# EAGLE design led_12led (EAGLE 7.7.0)
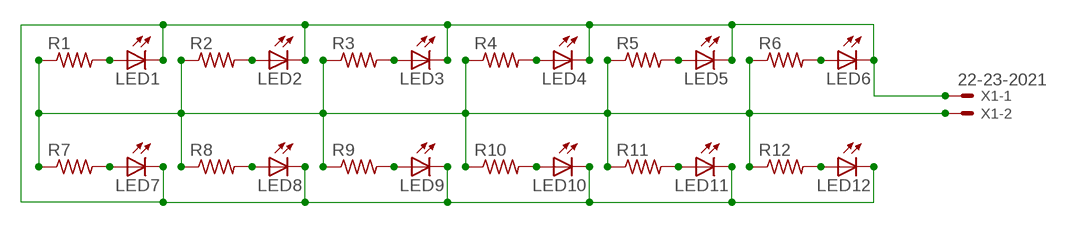
[diagram p0: schematic, sheet 1]

## Parts
LED1  LED3MM  [LED3MM]
LED2  LED3MM  [LED3MM]
LED3  LED3MM  [LED3MM]
LED4  LED3MM  [LED3MM]
LED5  LED3MM  [LED3MM]
LED6  LED3MM  [LED3MM]
LED7  LED3MM  [LED3MM]
LED8  LED3MM  [LED3MM]
LED9  LED3MM  [LED3MM]
LED10  LED3MM  [LED3MM]
LED11  LED3MM  [LED3MM]
LED12  LED3MM  [LED3MM]
R1  R-US_0309/12  [0309/12]
R2  R-US_0309/12  [0309/12]
R3  R-US_0309/12  [0309/12]
R4  R-US_0309/12  [0309/12]
R5  R-US_0309/12  [0309/12]
R6  R-US_0309/12  [0309/12]
R7  R-US_0309/12  [0309/12]
R8  R-US_0309/12  [0309/12]
R9  R-US_0309/12  [0309/12]
R10  R-US_0309/12  [0309/12]
R11  R-US_0309/12  [0309/12]
R12  R-US_0309/12  [0309/12]
X1  22-23-2021  [22-23-2021]

## Nets
N$1: R1.1 R2.1 R3.1 R4.1 R5.1 R6.1 R7.1 R8.1 R9.1 R10.1 R11.1 R12.1 X1.2
N$2: LED1.A R1.2
N$3: LED2.A R2.2
N$4: LED3.A R3.2
N$5: LED4.A R4.2
N$6: LED5.A R5.2
N$7: LED6.A R6.2
N$8: LED7.A R7.2
N$9: LED8.A R8.2
N$10: LED9.A R9.2
N$11: LED10.A R10.2
N$12: LED11.A R11.2
N$13: LED12.A R12.2
N$16: LED1.K(C) LED2.K(C) LED3.K(C) LED4.K(C) LED5.K(C) LED6.K(C) LED7.K(C) LED8.K(C) LED9.K(C) LED10.K(C) LED11.K(C) LED12.K(C) X1.1

## Library data of the parts
LED1-LED12 = led:LED: LED OSRAM: - CHIPLED LG R971, LG N971, LY N971, LG Q971, LY Q971, LO R971, LY R971 LH N974, LH R974 LS Q976, LO Q976, LY Q976 LO Q996 - Hyper CHIPLED LW Q18S LB Q993, LB Q99A, LB R99A - SideLED LS A670, LO A670, LY A670, LG A670, LP A670 LB A673, LV A673, LT A673, LW A673 LH A674 LY A675 LS A676, LA A676, LO A676, LY A676, LW A676 LS A679, LY A679, LG A679 - Hyper Micro SIDELED® LS Y876, LA Y876, LO Y876, LY Y876 LT Y87S - SmartLED LW L88C, LW L88S LB L89C, LB L89S, LG L890 LS L89K, LO L89K, LY L89K LS L896, LA L896, LO L896, LY L896 - TOPLED LS T670, LO T670, LY T670, LG T670, LP T670 LSG T670, LSP T670, LSY T670, LOP T670, LYG T670 LG T671, LOG T671, LSG T671 LB T673, LV T673, LT T673, LW T673 LH T674 LS T676, LA T676, LO T676, LY T676, LB T676, LH T676, LSB T676, LW T676 LB T67C, LV T67C, LT T67C, LS T67K, LO T67K, LY T67K, LW E67C LS E67B, LA E67B, LO E67B, LY E67B, LB E67C, LV E67C, LT E67C LW T67C LS T679, LY T679, LG T679 LS T770, LO T770, LY T770, LG T770, LP T770 LB T773, LV T773, LT T773, LW T773 LH T774 LS E675, LA E675, LY E675, LS T675 LS T776, LA T776, LO T776, LY T776, LB T776 LHGB T686 LT T68C, LB T68C - Hyper Mini TOPLED® LB M676 - Mini TOPLED Santana® LG M470 LS M47K, LO M47K, LY M47K Source: http://www.osram.convergy.de LUXEON: - LUMILED® LXK2-PW12-R00, LXK2-PW12-S00, LXK2-PW14-U00, LXK2-PW14-V00 LXK2-PM12-R00, LXK2-PM12-S00, LXK2-PM14-U00 LXK2-PE12-Q00, LXK2-PE12-R00, LXK2-PE12-S00, LXK2-PE14-T00, LXK2-PE14-U00 LXK2-PB12-K00, LXK2-PB12-L00, LXK2-PB12-M00, LXK2-PB14-N00, LXK2-PB14-P00, LXK2-PB14-Q00 LXK2-PR12-L00, LXK2-PR12-M00, LXK2-PR14-Q00, LXK2-PR14-R00 LXK2-PD12-Q00, LXK2-PD12-R00, LXK2-PD12-S00 LXK2-PH12-R00, LXK2-PH12-S00 LXK2-PL12-P00, LXK2-PL12-Q00, LXK2-PL12-R00 Source: www.luxeon.com KINGBRIGHT: KA-3528ASYC Source: www.kingbright.com
R1-R12 = resistor:R-US_: RESISTOR, American symbol
X1 = con-molex:22-23-2021: .100" (2.54mm) Center Header - 2 Pin; MF: MOLEX; MPN: 22-23-2021; OC_FARNELL: 1462926; OC_NEWARK: 25C3832

## Board
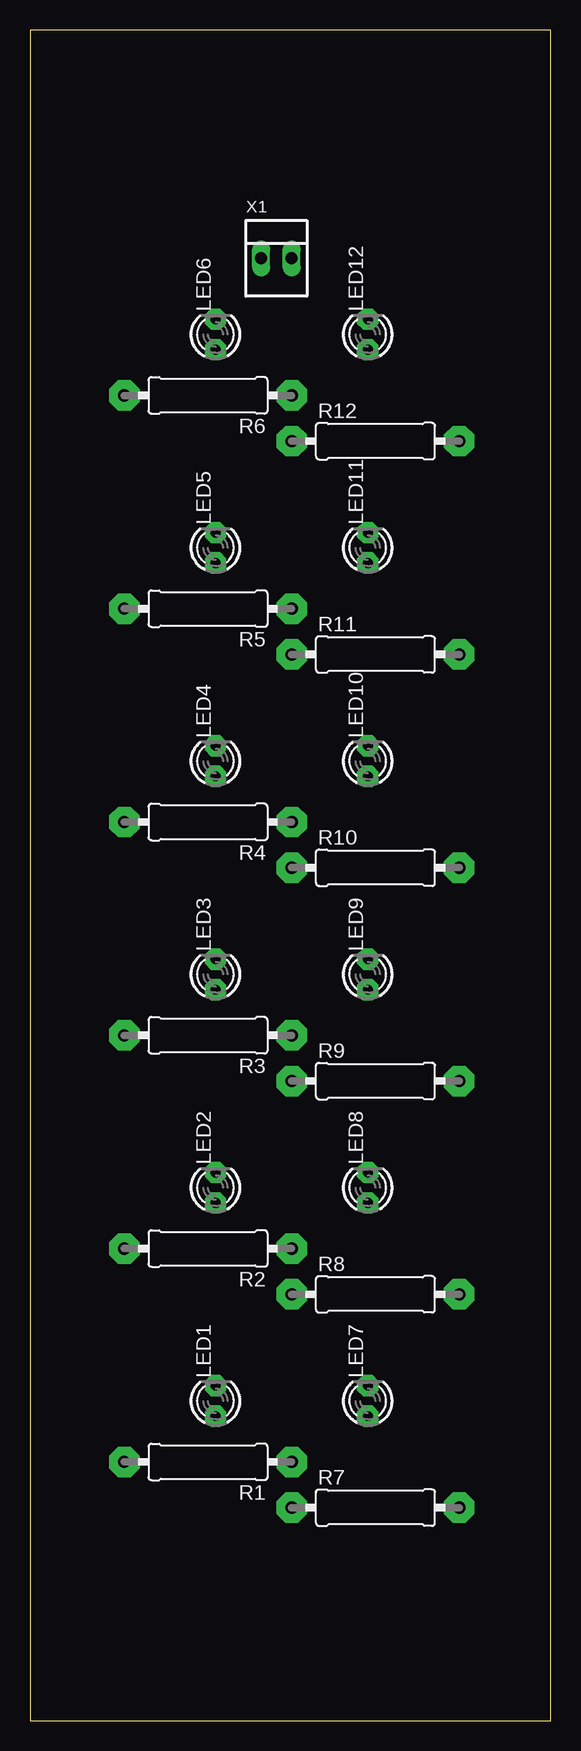
[diagram p1: board, top side]
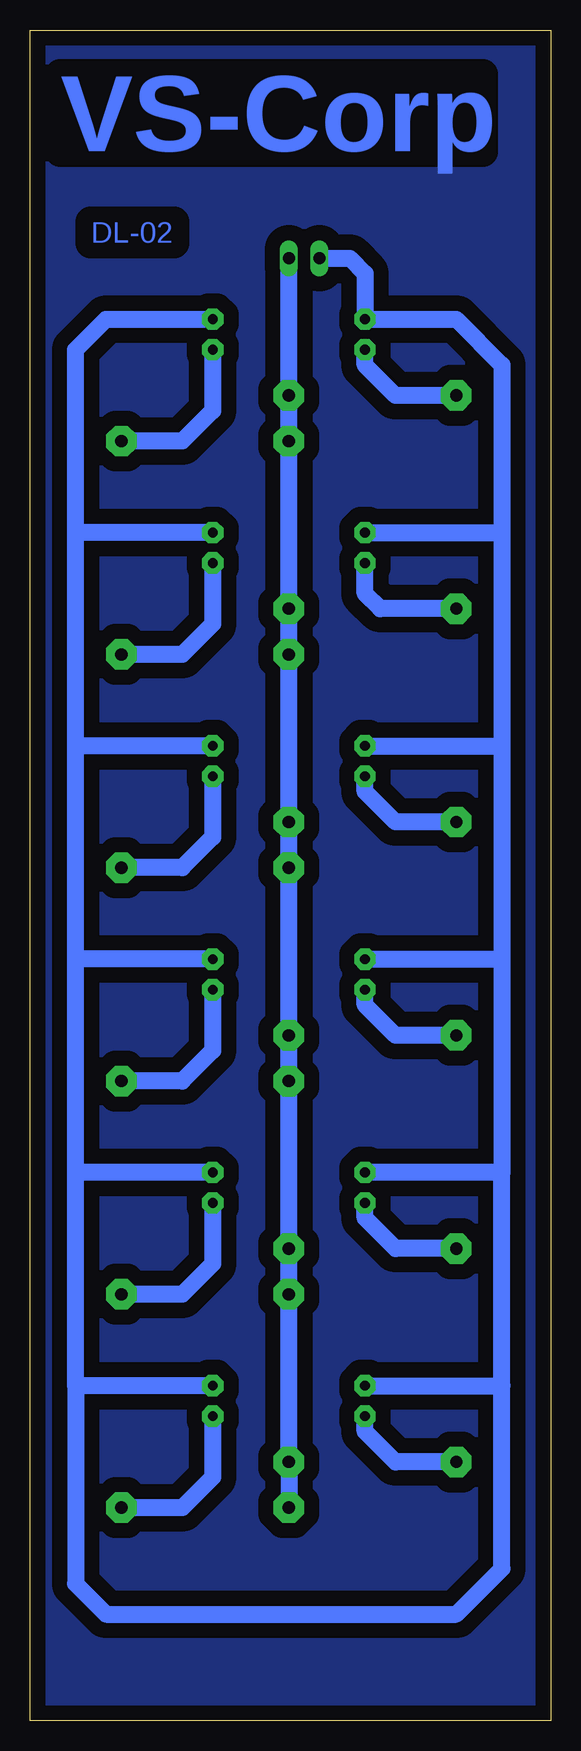
[diagram p2: board, bottom side, seen from below]

Size 43.42 x 140.95 mm. Coordinates in mm from the lower left corner, seen from the top.
Outline: 43.42,0 43.42,140.95 0,140.95 0,0 43.42,0
Copper layers (1*16): Top 0.035mm / dielectric 1.5mm / Bottom 0.035mm
Design rules "default": minimum track width 10mil, minimum drill 24mil, track to track 8mil, track to pad 8mil, pad to pad 8mil, via to via 8mil, smd to smd 8mil, copper to edge 40mil, drill to drill 8mil, minimum pad ring 10mil, minimum via ring 8mil, stop-mask expansion 4mil, vias tented up to drill 0mil, thermal gap 10mil

### Footprints (pad centres in the part's own frame; a part is rotated, then mirrored left to right if it is on the bottom)
LED3MM = drill 0.813 pad 1.778 octagon: A -1.27,0; K 1.27,0
0309/12 = drill 1.016 pad 2.54 octagon: 1 -6.35,0; 2 7.62,0
22-23-2021 = drill 1 long: 1 -1.27,0; 2 1.27,0

### Placement (x,y rotation side)
LED1  15.48,26.67 90 top
LED2  15.48,44.45 90 top
LED3  15.48,62.23 90 top
LED4  15.48,80.01 90 top
LED5  15.48,97.79 90 top
LED6  15.48,115.57 90 top
LED7  28.18,26.67 90 top
LED8  28.18,44.45 90 top
LED9  28.18,62.23 90 top
LED10  28.18,80.01 90 top
LED11  28.18,97.79 90 top
LED12  28.18,115.57 90 top
R1  15.48,21.59 180 top
R2  15.48,39.37 180 top
R3  15.48,57.15 180 top
R4  15.48,74.93 180 top
R5  15.48,92.71 180 top
R6  15.48,110.49 180 top
R7  28.18,17.78 0 top
R8  28.18,35.56 0 top
R9  28.18,53.34 0 top
R10  28.18,71.12 0 top
R11  28.18,88.9 0 top
R12  28.18,106.68 0 top
X1  20.56,121.92 0 top

### Tracks (layer width: path | path; a pad name or v marks a point on that pad's centre or on a via)
N$1
  Bottom 1.422: R7.1 R1.1 R8.1 R2.1 R9.1 R3.1 R10.1 R4.1 R11.1 R5.1 R12.1 R6.1 X1.2
N$2
  Bottom 1.422: R1.2 12.94,21.59 15.48,24.13 LED1.A
N$3
  Bottom 1.422: R2.2 12.94,39.37 15.48,41.91 LED2.A
N$4
  Bottom 1.422: R3.2 12.94,57.15 15.48,59.69 LED3.A
N$5
  Bottom 1.422: R4.2 12.94,74.93 15.48,77.47 LED4.A
N$6
  Bottom 1.422: R5.2 14.21,92.71 15.48,93.98 LED5.A
N$7
  Bottom 1.422: R6.2 12.94,110.49 15.48,113.03 LED6.A
N$8
  Bottom 1.422: LED7.A 28.18,20.32 30.72,17.78 R7.2
N$9
  Bottom 1.422: LED8.A 28.18,38.1 30.72,35.56 R8.2
N$10
  Bottom 1.422: LED9.A 28.18,55.88 30.72,53.34 R9.2
N$11
  Bottom 1.422: LED10.A 28.18,73.66 30.72,71.12 R10.2
N$12
  Bottom 1.422: LED11.A 28.18,91.44 30.72,88.9 R11.2
N$13
  Bottom 1.422: LED12.A 28.18,109.22 30.72,106.68 R12.2
N$14
  pour Bottom (isolate 1.27): 0.24,140.97 43.42,140.97 43.42,0 0.24,0
N$16
  Bottom 1.422: 4.05,45.72 LED2.K | 4.05,99.06 4.05,113.03 7.86,116.84 LED6.K 15.48,120.65 16.75,121.92 X1.1 | 4.05,99.06 4.05,81.28 | 4.05,81.28 4.05,63.5 | 4.05,63.5 4.05,45.72 | LED3.K 4.05,63.5 | LED4.K 4.05,81.28 | LED5.K 4.05,99.06 | LED7.K 39.61,27.94 | 39.61,27.94 39.61,11.43 37.07,8.89 7.86,8.89 4.05,12.7 4.05,27.94 | 4.05,27.94 4.05,45.72 | LED1.K 4.05,27.94 | 39.61,27.94 39.61,45.72 | 39.61,45.72 39.61,63.5 | 39.61,63.5 39.61,81.28 | 39.61,81.28 39.61,99.06 | 39.61,99.06 39.61,114.3 37.07,116.84 LED12.K | LED8.K 39.61,45.72 | LED9.K 39.61,63.5 | LED10.K 39.61,81.28 | LED11.K 39.61,99.06

### Text on the board
Bottom: VS-Corp | DL-02